# Altium project LPF-400kHz-OPA820-THT.PrjPcb
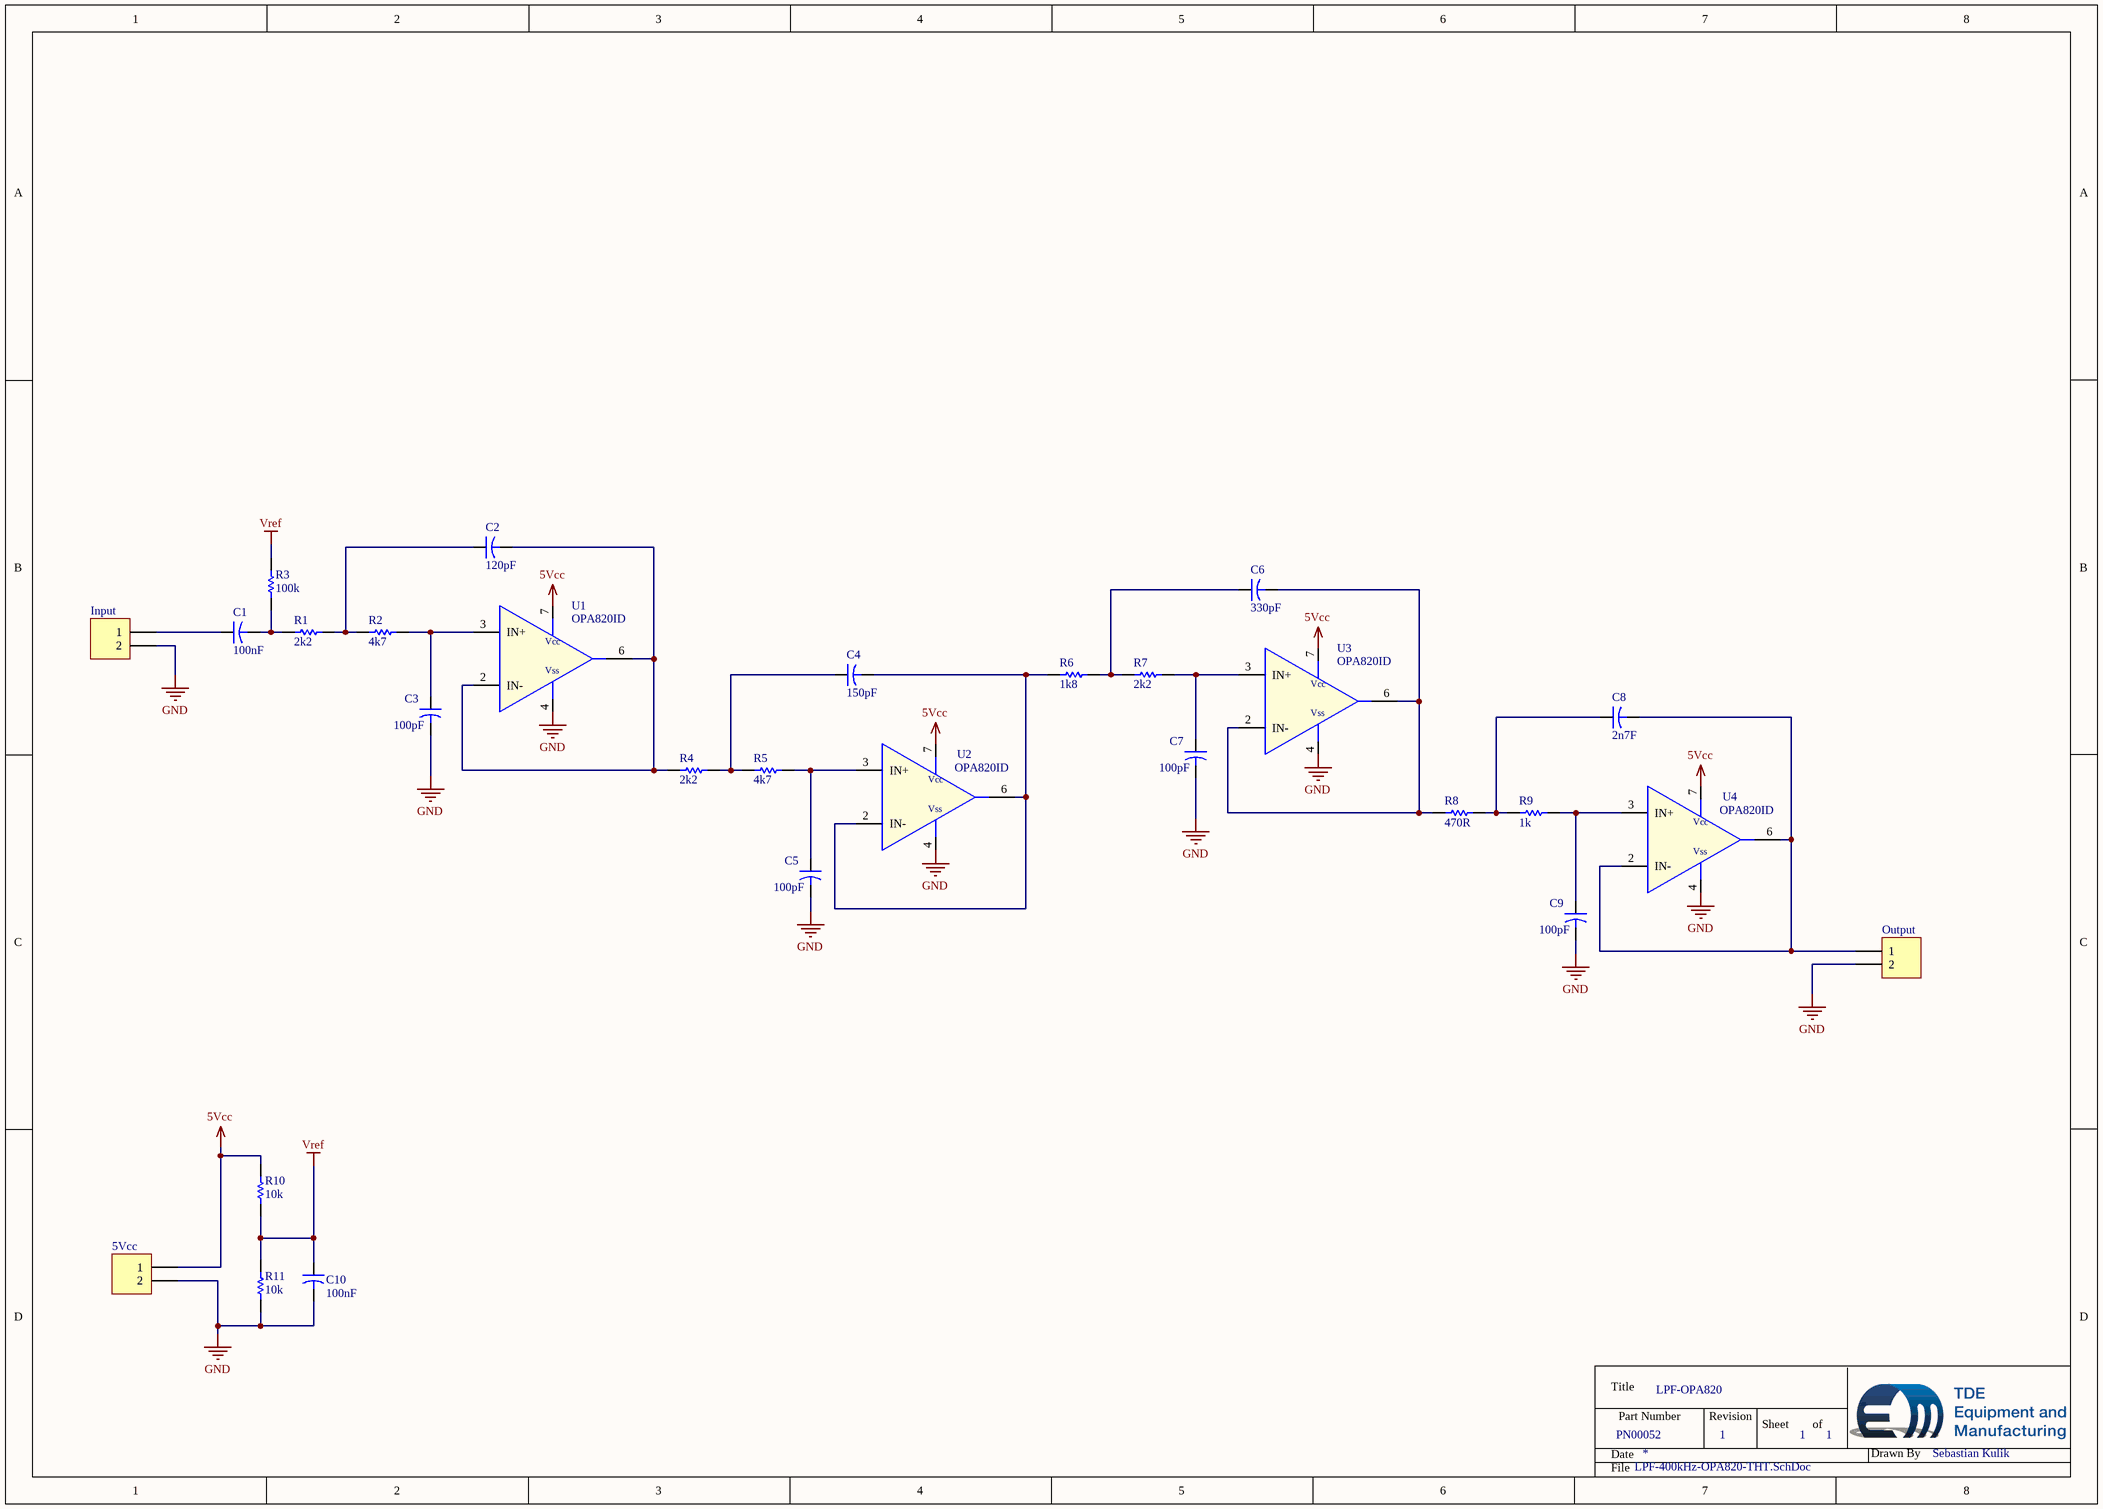
[diagram p0: LPF-400kHz-OPA820-THT.SchDoc]
1 sheet, 28 parts. Net scope: global (net labels, ports and power ports of the same name join across sheets).
Board file: LPF-400kHz-OPA820-THT.PcbDoc

## Sheet LPF-400kHz-OPA820-THT.SchDoc: LPF-OPA820
size A3; Revision: 1; SheetNumber: 1; SheetTotal: 1; PartNumber: PN00052; Drawn By: Sebastian Kulik; ProjectName: LPF-OPA820

### Parts
5Vcc  PHOENIX_1715721  [Phoenix-2-5_08]  (value not drawn)
C1  value 100nF  [Dummy-10mm]  (hidden comment: Capacitor-Dummy-THT)
C2  value 120pF  [Dummy-10mm]  (hidden comment: Capacitor-Dummy-THT)
C3  value 100pF  [Dummy-10mm]  (hidden comment: Capacitor-Dummy-THT)
C4  value 150pF  [Dummy-10mm]  (hidden comment: Capacitor-Dummy-THT)
C5  value 100pF  [Dummy-10mm]  (hidden comment: Capacitor-Dummy-THT)
C6  value 330pF  [Dummy-10mm]  (hidden comment: Capacitor-Dummy-THT)
C7  value 100pF  [Dummy-10mm]  (hidden comment: Capacitor-Dummy-THT)
C8  value 2n7F  [Dummy-10mm]  (hidden comment: Capacitor-Dummy-THT)
C9  value 100pF  [Dummy-10mm]  (hidden comment: Capacitor-Dummy-THT)
C10  value 100nF  [Dummy-10mm]  (hidden comment: Capacitor-Dummy-THT)
Input  PHOENIX_1715721  [Phoenix-2-5_08]  (value not drawn)
Output  PHOENIX_1715721  [Phoenix-2-5_08]  (value not drawn)
R1  value 2k2  [Dummy-10mm]  (hidden comment: Resistor-Dummy-THT)
R2  value 4k7  [Dummy-10mm]  (hidden comment: Resistor-Dummy-THT)
R3  value 100k  [Dummy-10mm]  (hidden comment: Resistor-Dummy-THT)
R4  value 2k2  [Dummy-10mm]  (hidden comment: Resistor-Dummy-THT)
R5  value 4k7  [Dummy-10mm]  (hidden comment: Resistor-Dummy-THT)
R6  value 1k8  [Dummy-10mm]  (hidden comment: Resistor-Dummy-THT)
R7  value 2k2  [Dummy-10mm]  (hidden comment: Resistor-Dummy-THT)
R8  value 470R  [Dummy-10mm]  (hidden comment: Resistor-Dummy-THT)
R9  value 1k  [Dummy-10mm]  (hidden comment: Resistor-Dummy-THT)
R10  value 10k  [Dummy-10mm]  (hidden comment: Resistor-Dummy-THT)
R11  value 10k  [Dummy-10mm]  (hidden comment: Resistor-Dummy-THT)
U1  OPA820ID  [SOP8_L]
U2  OPA820ID  [SOP8_L]
U3  OPA820ID  [SOP8_L]
U4  OPA820ID  [SOP8_L]

### Nets
5Vcc: 5Vcc.1 R10.2 U1.7(Vcc) U2.7(Vcc) U3.7(Vcc) U4.7(Vcc)
GND: 5Vcc.2 C3.2 C5.2 C7.2 C9.2 C10.2 Input.2 Output.2 R11.1 U1.4(Vss) U2.4(Vss) U3.4(Vss) U4.4(Vss)
Vref: C10.1 R3.2 R10.1 R11.2
NetC1_1: C1.1 Input.1
NetC1_2: C1.2 R1.1 R3.1
NetC2_1: C2.1 R1.2 R2.1
NetC2_2: C2.2 R4.1 U1.2(IN-) U1.6(OUT)
NetC3_1: C3.1 R2.2 U1.3(IN+)
NetC4_1: C4.1 R4.2 R5.1
NetC4_2: C4.2 R6.1 U2.2(IN-) U2.6(OUT)
NetC5_1: C5.1 R5.2 U2.3(IN+)
NetC6_1: C6.1 R6.2 R7.1
NetC6_2: C6.2 R8.1 U3.2(IN-) U3.6(OUT)
NetC7_1: C7.1 R7.2 U3.3(IN+)
NetC8_1: C8.1 R8.2 R9.1
NetC8_2: C8.2 Output.1 U4.2(IN-) U4.6(OUT)
NetC9_1: C9.1 R9.2 U4.3(IN+)

### Notes on the sheet
- Title
- Date
- Part Number
- Revision
- Sheet
- of
- Drawn By
- File

### Library data of the parts
5Vcc Input Output = 2Pol_1715721: Phoenix, 2 pol, 5.08mm, 22A, 715721; Deliverer PartNr: 193-0564; Deliverer: RS; TDE-PN: CON0008; LatestRevisionDate: 02.05.2014; LatestRevisionNote: Re-released for DXP Platform.; Publisher: Sebastian Kulik; Manufacturer PartNr: 1715721; Manufacturer: Phoenix; PackageDescription: Phoenix-2-5_08; Price: 0.976/5
C1 C10 = Capacitor-Dummy-THT: Deliverer PartNr: 721-5240; Deliverer: RS; Published: 08.12.2015; Part Description: Capacitor-Dummy-THT; Publisher: Sebastian Kulik; PackageDescription: -; Manufacturer: -; Manufacturer PartNr: -; TDE-PN: -; Price: 0.081/50
C2 = Capacitor-Dummy-THT: Deliverer PartNr: 716-7217; Deliverer: RS; Published: 08.12.2015; Part Description: Capacitor-Dummy-THT; Publisher: Sebastian Kulik; PackageDescription: -; Manufacturer: -; Manufacturer PartNr: -; TDE-PN: -; Price: 0.154/50
C3 C5 C7 C9 = Capacitor-Dummy-THT: Deliverer PartNr: 117-344; Deliverer: RS; Published: 08.12.2015; Part Description: Capacitor-Dummy-THT; Publisher: Sebastian Kulik; PackageDescription: -; Manufacturer: -; Manufacturer PartNr: -; TDE-PN: -; Price: 0.09/10
C4 = Capacitor-Dummy-THT: Deliverer PartNr: 652-9888; Deliverer: RS; Published: 08.12.2015; Part Description: Capacitor-Dummy-THT; Publisher: Sebastian Kulik; PackageDescription: -; Manufacturer: -; Manufacturer PartNr: -; TDE-PN: -; Price: 0.223/25
C6 = Capacitor-Dummy-THT: Deliverer PartNr: 652-9923; Deliverer: RS; Published: 08.12.2015; Part Description: Capacitor-Dummy-THT; Publisher: Sebastian Kulik; PackageDescription: -; Manufacturer: -; Manufacturer PartNr: -; TDE-PN: -; Price: 0.223/25
C8 = Capacitor-Dummy-THT: Deliverer PartNr: 716-7197; Deliverer: RS; Published: 08.12.2015; Part Description: Capacitor-Dummy-THT; Publisher: Sebastian Kulik; PackageDescription: -; Manufacturer: -; Manufacturer PartNr: -; TDE-PN: -; Price: 0.20/10
R1 R4 R7 = Resistor-Dummy-THT: Deliverer PartNr: 124-2865; Deliverer: RS; Published: 08.12.2015; Publisher: Sebastian Kulik; PackageDescription: -; Manufacturer: -; Manufacturer PartNr: -; TDE-PN: -; Part Desicription: Resistor-Dummy-THT; Price: 0.189/50
R2 R5 = Resistor-Dummy-THT: Deliverer PartNr: 683-3799; Deliverer: RS; Published: 08.12.2015; Publisher: Sebastian Kulik; PackageDescription: -; Manufacturer: -; Manufacturer PartNr: -; TDE-PN: -; Part Desicription: Resistor-Dummy-THT; Price: 0.107/25
R3 = Resistor-Dummy-THT: Deliverer PartNr: 148-972; Deliverer: RS; Published: 08.12.2015; Publisher: Sebastian Kulik; PackageDescription: -; Manufacturer: -; Manufacturer PartNr: -; TDE-PN: -; Part Desicription: Resistor-Dummy-THT; Price: 0.027/10
R6 = Resistor-Dummy-THT: Deliverer PartNr: 683-3231; Deliverer: RS; Published: 08.12.2015; Publisher: Sebastian Kulik; PackageDescription: -; Manufacturer: -; Manufacturer PartNr: -; TDE-PN: -; Part Desicription: Resistor-Dummy-THT; Price: 0.016/25
R8 = Resistor-Dummy-THT: Deliverer PartNr: 683-2869; Deliverer: RS; Published: 08.12.2015; Publisher: Sebastian Kulik; PackageDescription: -; Manufacturer: -; Manufacturer PartNr: -; TDE-PN: -; Part Desicription: Resistor-Dummy-THT; Price: 0.057/25
R9 = Resistor-Dummy-THT: Deliverer PartNr: 148-253; Deliverer: RS; Published: 08.12.2015; Publisher: Sebastian Kulik; PackageDescription: -; Manufacturer: -; Manufacturer PartNr: -; TDE-PN: -; Part Desicription: Resistor-Dummy-THT; Price: 0.046/10
R10 R11 = Resistor-Dummy-THT: Deliverer PartNr: 148-736; Deliverer: RS; Published: 08.12.2015; Publisher: Sebastian Kulik; PackageDescription: -; Manufacturer: -; Manufacturer PartNr: -; TDE-PN: -; Part Desicription: Resistor-Dummy-THT; Price: 0.027/10
U1-U4 = OPA820ID: High speed OP, 260MHz; Deliverer PartNr: 661-1053; Manufacturer: TI; Deliverer: RS; TDE-PN: IC00077; Published: 31.05.2016; PackageDescription: TSSOP8; Publisher: Sebastian Kulik; Manufacturer PartNr: OPA820ID; Price: 2.548/5